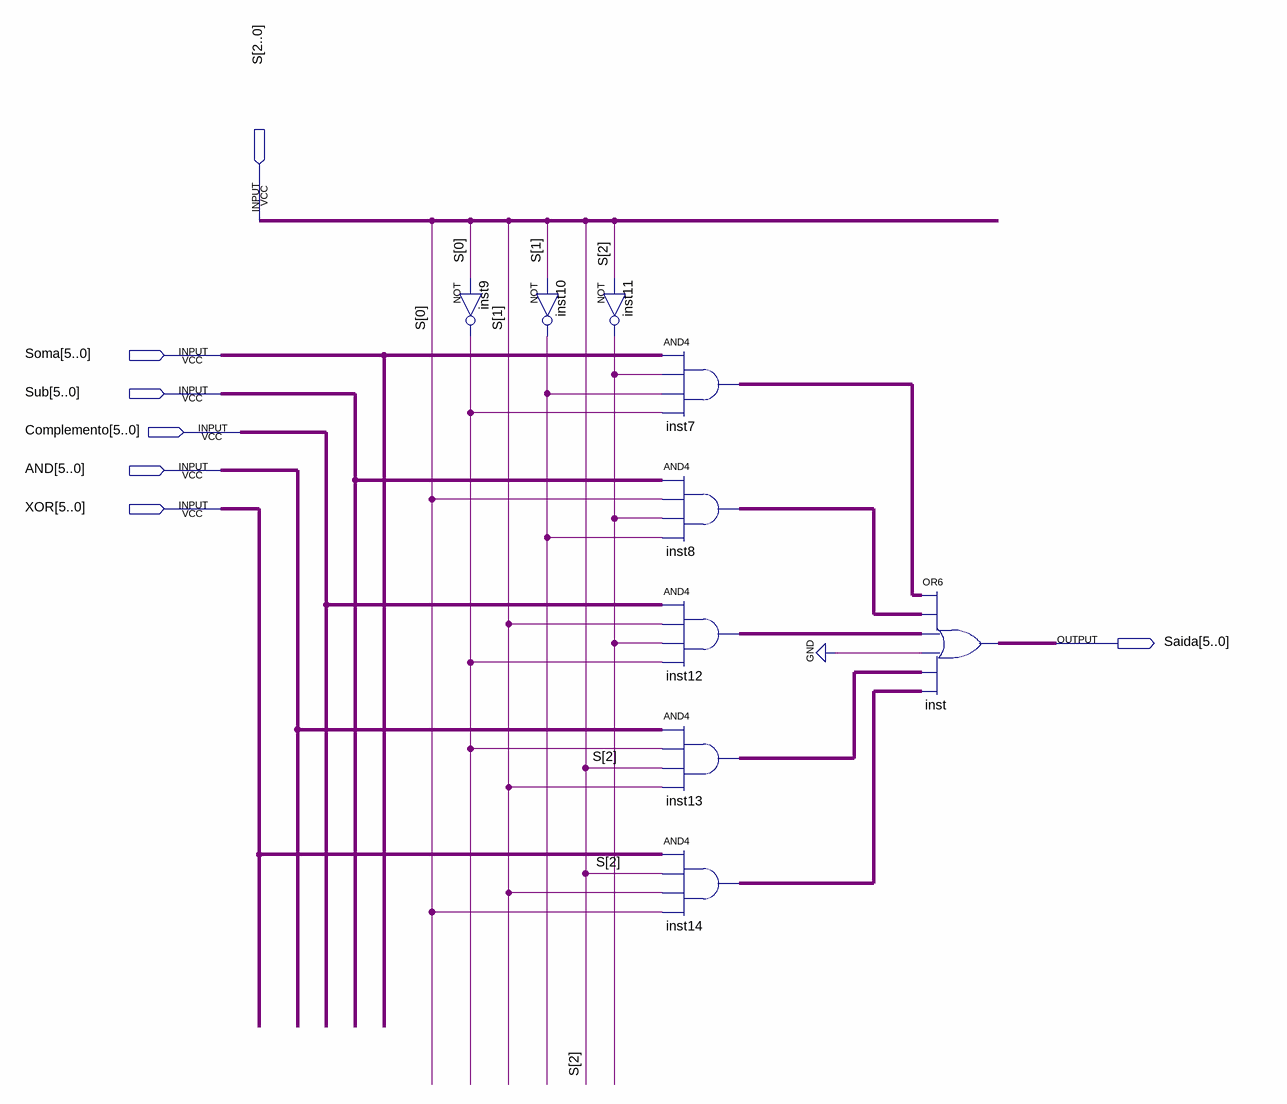
[diagram p0: schematic sheet]
// Quartus schematic MUX5Bits.bdf as structural Verilog: 9 symbols, 7 pins
module MUX5Bits (
  input  [2:0] S,
  input  [5:0] Soma,
  input  [5:0] Sub,
  input  [5:0] Complemento,
  input  [5:0] AND,
  input  [5:0] XOR,
  output [5:0] Saida
);

  wire inst9_out, inst10_out, inst11_out;
  wire [5:0] inst7_out, inst8_out, inst12_out, inst13_out, inst14_out;

  not inst9 (inst9_out, S[0]);
  not inst10 (inst10_out, S[1]);
  not inst11 (inst11_out, S[2]);
  assign inst7_out = Soma & {6{inst11_out}} & {6{inst10_out}} & {6{inst9_out}};  // AND4 inst7, 6 bits wide
  assign inst8_out = Sub & {6{S[0]}} & {6{inst11_out}} & {6{inst10_out}};  // AND4 inst8, 6 bits wide
  assign inst12_out = Complemento & {6{S[1]}} & {6{inst11_out}} & {6{inst9_out}};  // AND4 inst12, 6 bits wide
  assign inst13_out = AND & {6{inst9_out}} & {6{S[2]}} & {6{S[1]}};  // AND4 inst13, 6 bits wide
  assign inst14_out = XOR & {6{S[2]}} & {6{S[1]}} & {6{S[0]}};  // AND4 inst14, 6 bits wide
  assign Saida = inst7_out | inst8_out | inst12_out | {6{1'b0}} | inst13_out | inst14_out;  // OR6 inst, 6 bits wide
endmodule
